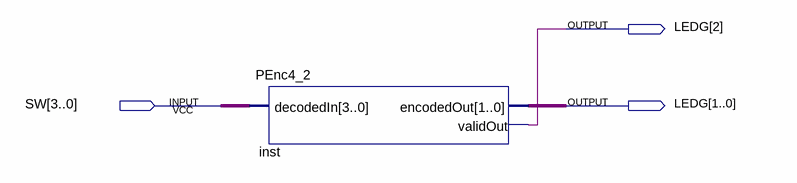
[diagram p0: schematic sheet]
// Quartus schematic PEnc4_2Demo.bdf as structural Verilog: 1 symbols, 3 pins
module PEnc4_2Demo (
  input  [3:0] SW,
  output [2:0] LEDG
);

  PEnc4_2 inst (.decodedIn(SW), .encodedOut(LEDG[1:0]), .validOut(LEDG[2]));
endmodule
